# Altium schematic sheet FlyWheel_UI.SchDoc
size A1; SheetNumber: 1; SheetTotal: 1; SPICEModelCacheKDAIGYVS: <root> / <DocumentId>KDAIGYVS</DocumentId> / <CacheFrame Number="0"> / <Model Name="7850_74477530_1m" Kind="CKT"> / <Text>******* / .subckt 7850_74477530_1m 1 2 / Rp 1 2 187304.915771 / Cp 1 2 4.36976277949p / Rs 1 N3 3.3 / L1 N3 2 1000u / .ends 7850_74477530_1m</Text> / </Model> / </CacheFrame> / </root>
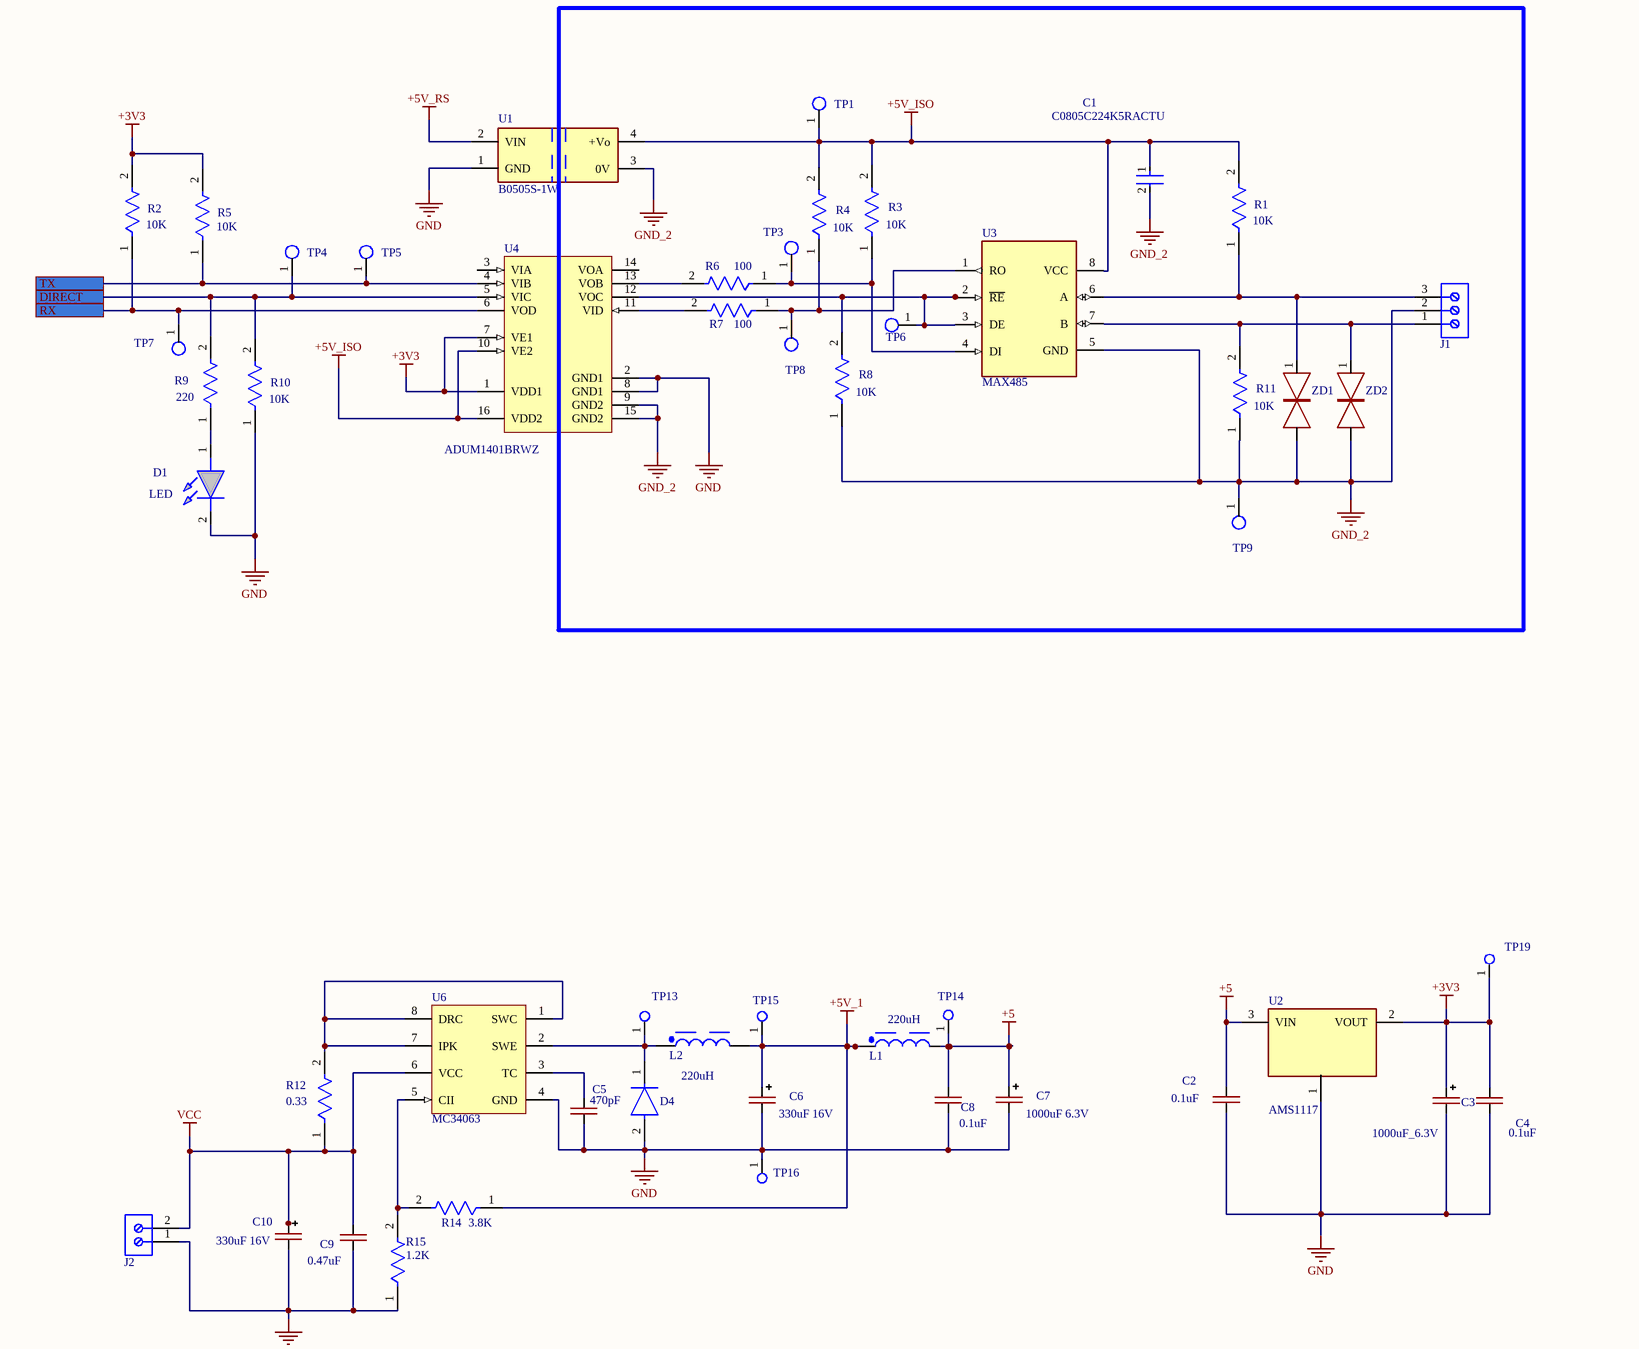
[diagram p0: FlyWheel_UI.SchDoc, top left]
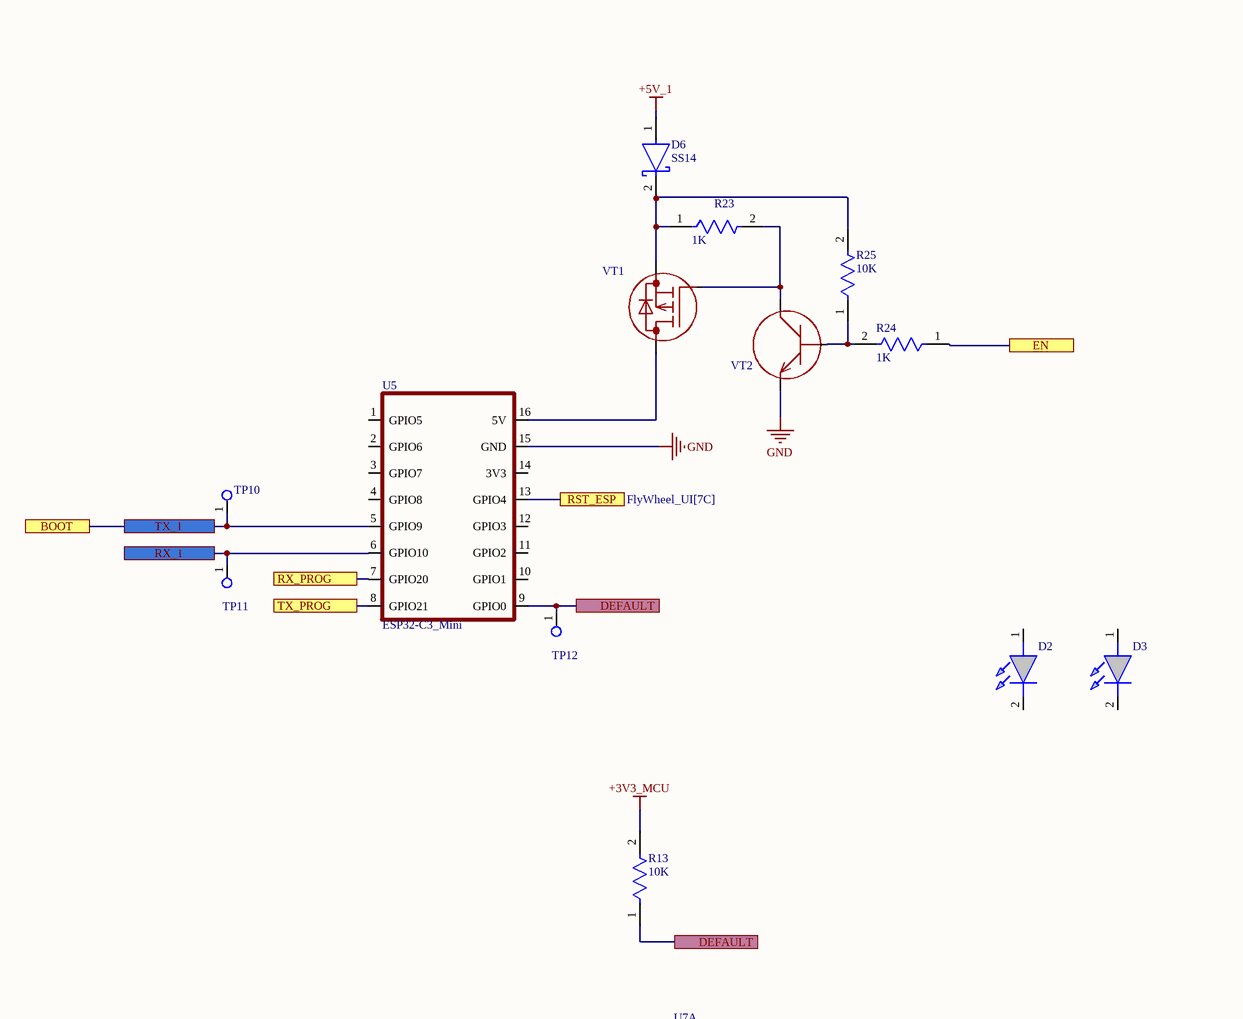
[diagram p1: FlyWheel_UI.SchDoc, top right]
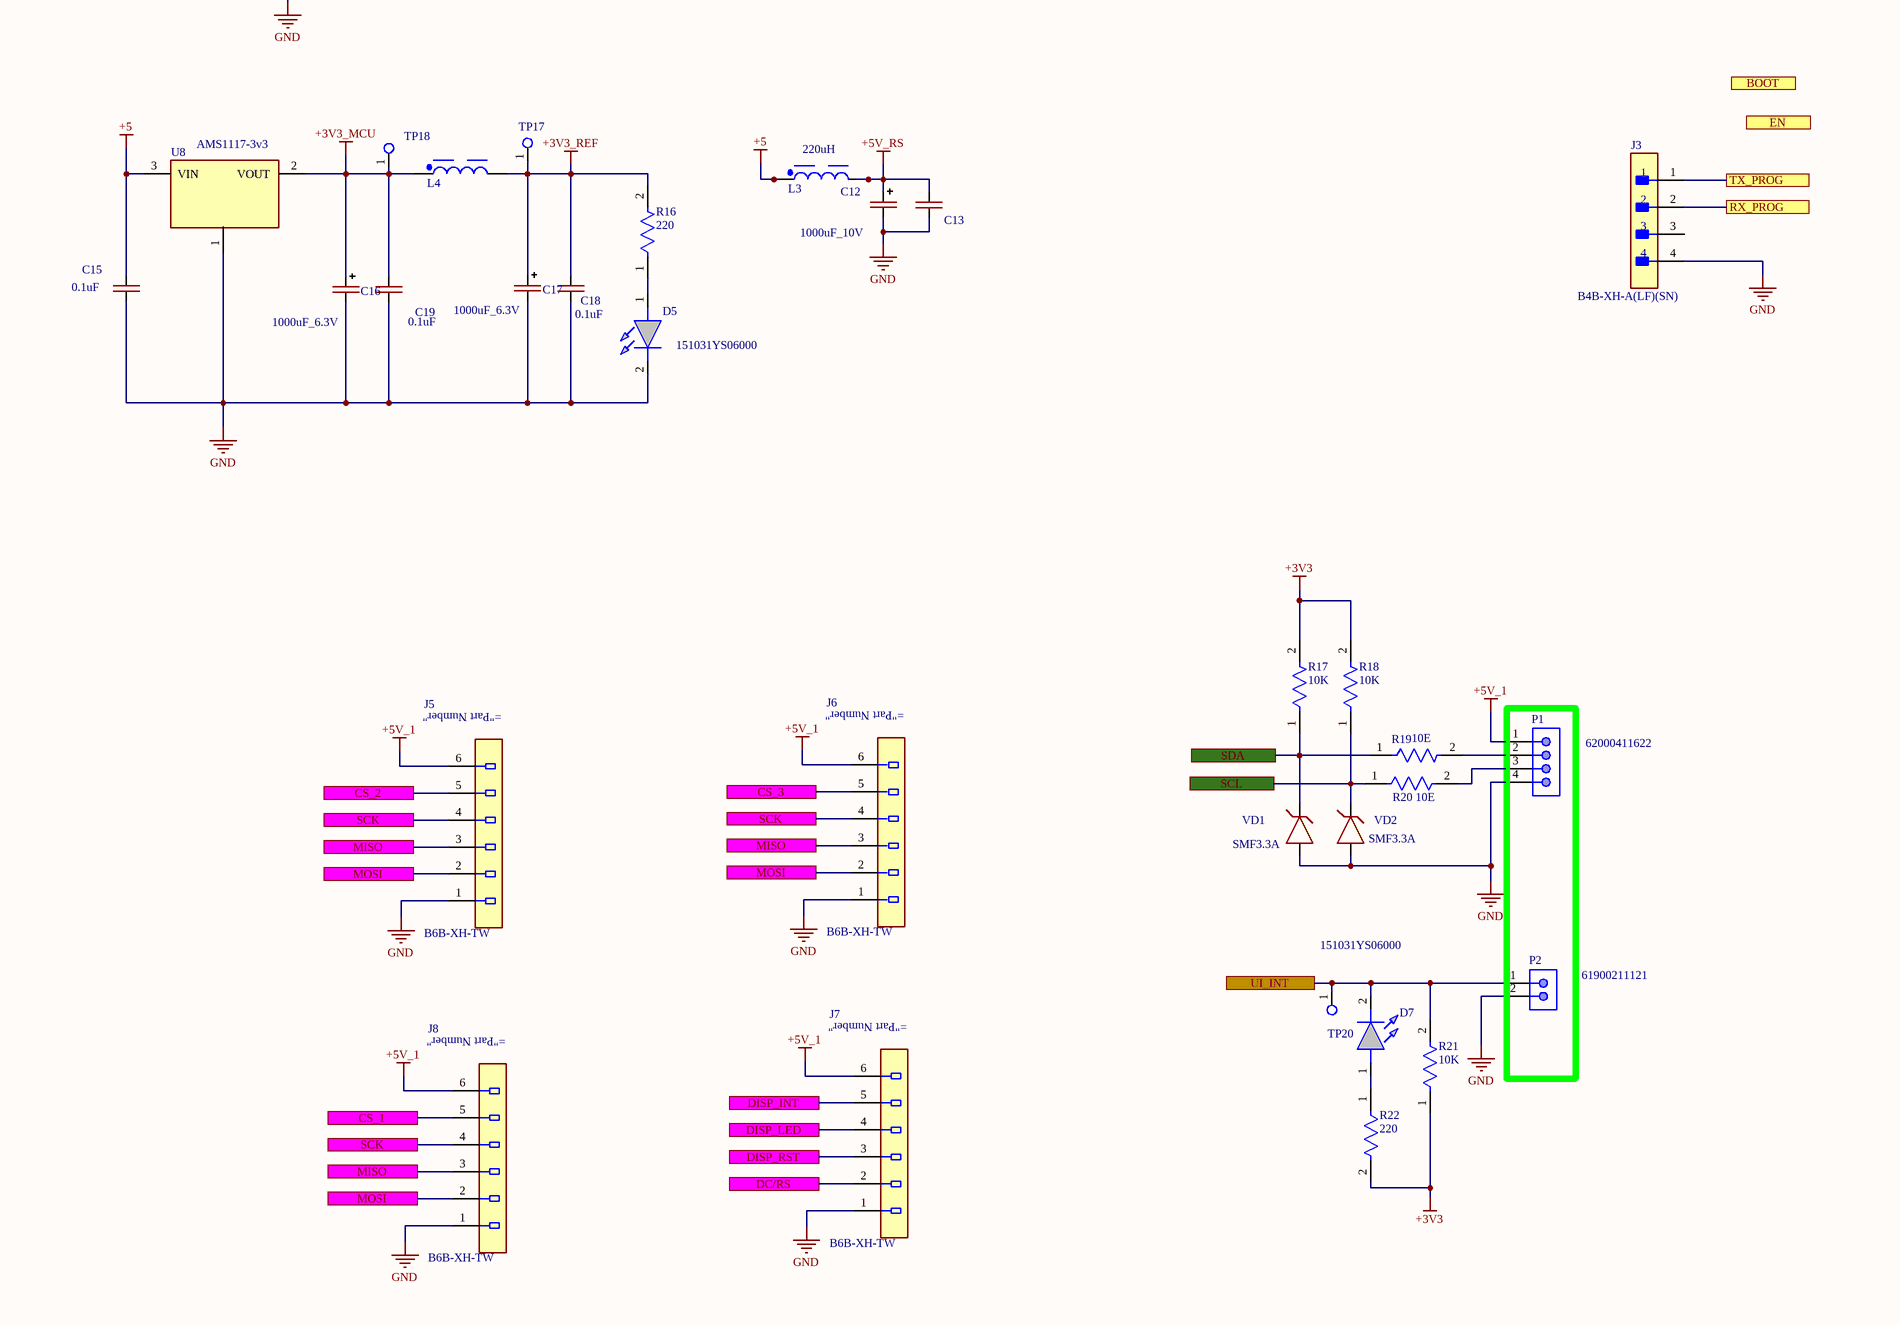
[diagram p2: FlyWheel_UI.SchDoc, bottom left]
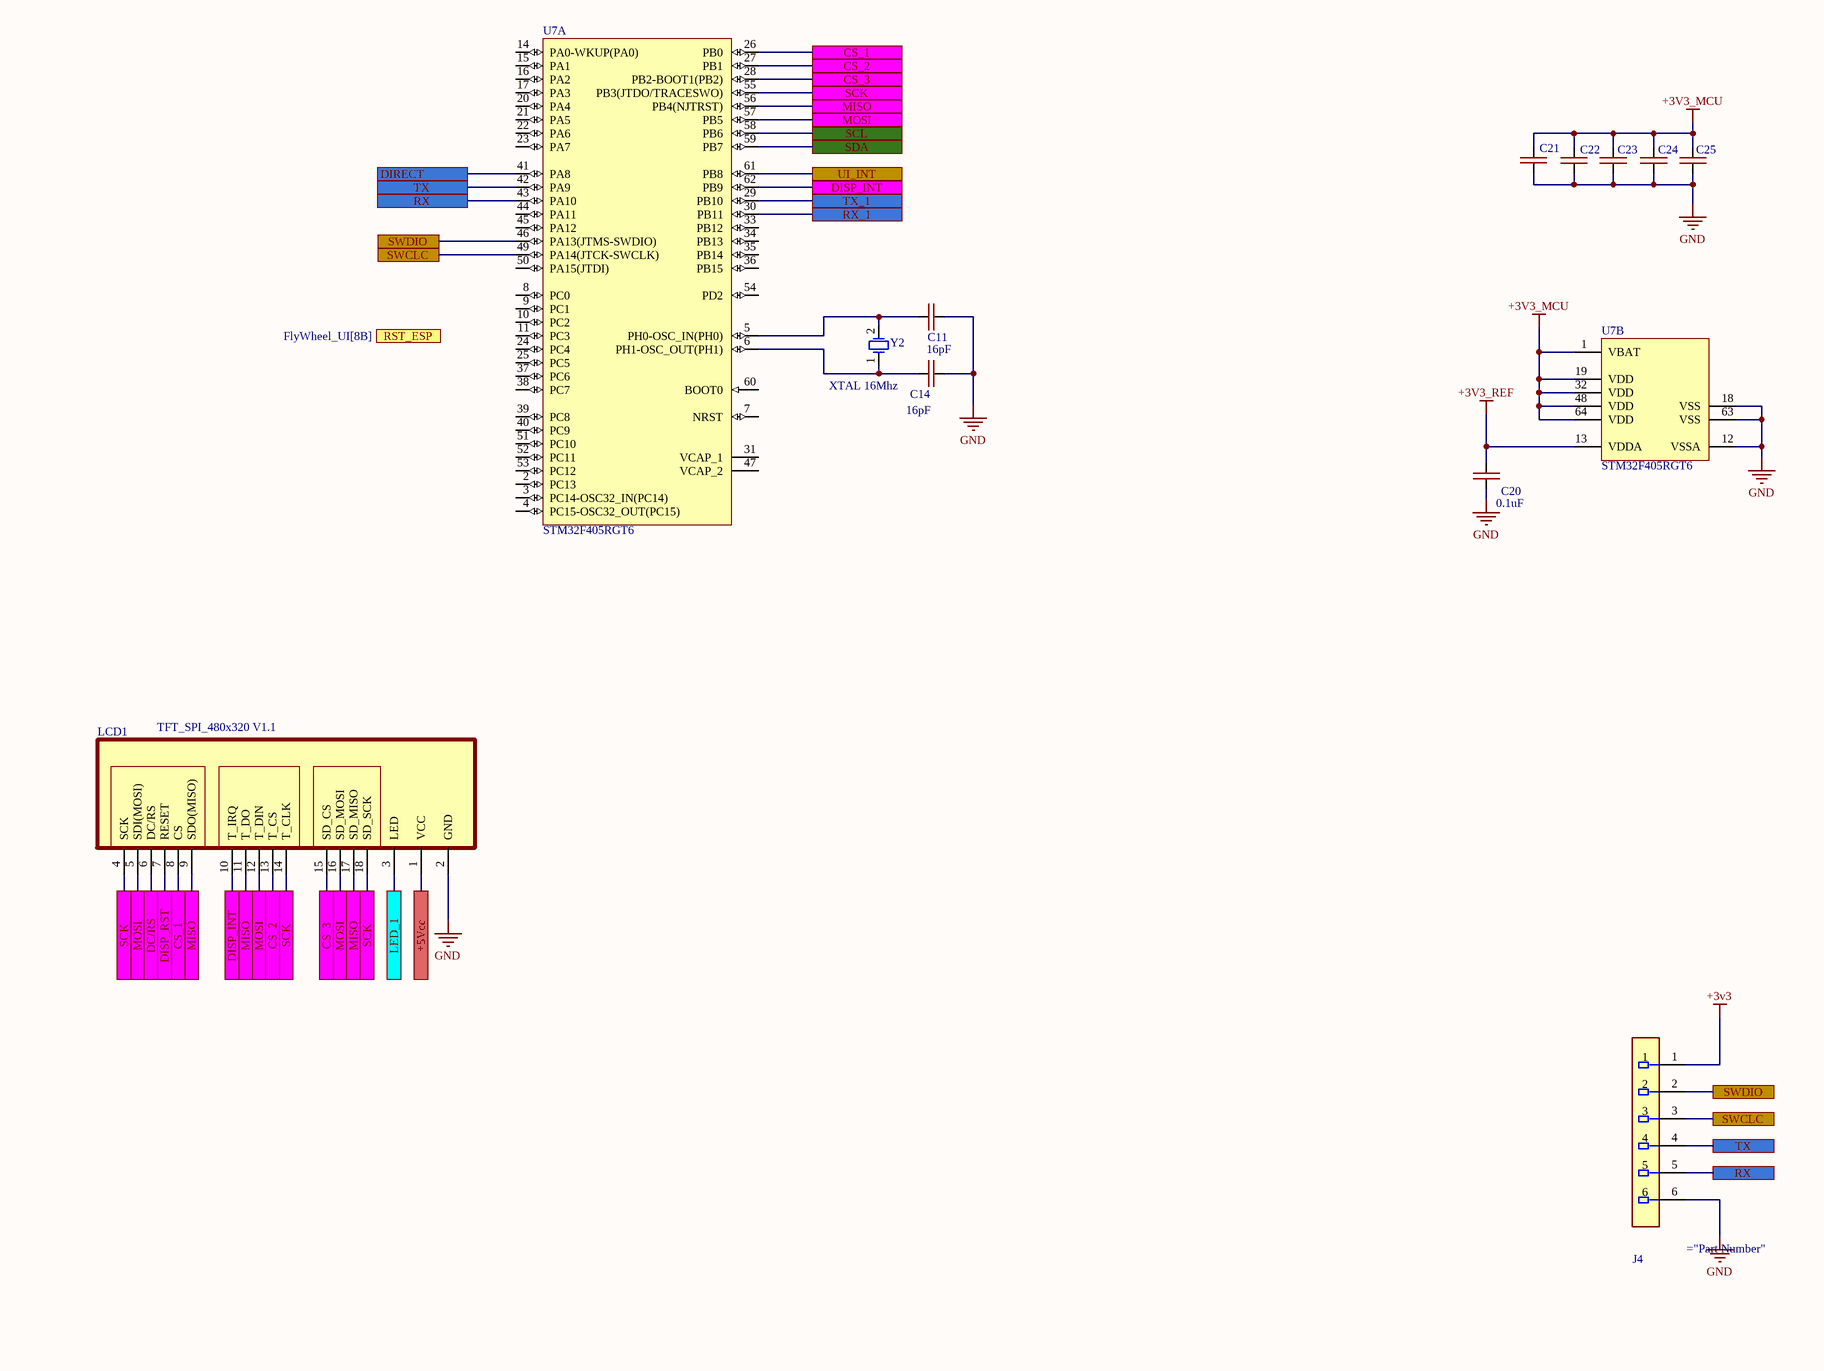
[diagram p3: FlyWheel_UI.SchDoc, bottom right]

## Parts
C1  C0805C224K5RACTU  [FP-C0805C-DN-MFG]
C2  0.1uF  [CAP-0805]
C3  1000uF_6.3V  [CAP_SMD_Size_E]
C4  0.1uF  [CAP-0805]
C5  470pF  [CAP-0805]
C6  330uF 16V  [CAP_SMD_Size_E]
C7  1000uF 6.3V  [CAP_SMD_Size_E]
C8  0.1uF  [CAP-0805]
C9  0.47uF  [CAP-0805]
C10  330uF 16V  [CAP_SMD_Size_E]
C11  16pF  [CAP-0805]
C12  1000uF_10V  [CAP_SMD_Size_G]
C13  CAP-NON-POLAR  [CAP-0805]  (value not drawn)
C14  16pF  [CAP-0805]
C15  0.1uF  [CAP-0805]
C16  1000uF_6.3V  [CAP_SMD_Size_E]
C17  1000uF_6.3V  [CAP_SMD_Size_E]
C18  0.1uF  [CAP-0805]
C19  0.1uF  [CAP-0805]
C20  0.1uF  [CAP-0805]
C21  CAP-NON-POLAR  [CAP-0805]  (value not drawn)
C22  CAP-NON-POLAR  [CAP-0805]  (value not drawn)
C23  CAP-NON-POLAR  [CAP-0805]  (value not drawn)
C24  CAP-NON-POLAR  [CAP-0805]  (value not drawn)
C25  CAP-NON-POLAR  [CAP-0805]  (value not drawn)
D1  LED  [LED_BLUE]
D2  151031YS06000  [LED_BLUE]  (value not drawn)
D3  151031YS06000  [LED_RED]  (value not drawn)
D4  US1G  [US1G_SMA]  (value not drawn)
D5  151031YS06000  [LED_GREEN]
D6  SS14  [DO-214-AC]
D7  151031YS06000  [LED_RED]
J1  (no value)  [691101710003]
J2  691101710002  [691101710002]  (value not drawn)
J3  B4B-XH-A(LF)(SN)  [B4B-XH-A]
J4  SWR25X-NRTC-S06-ST-BA  [Sullins_SWR25X-NRTC-S06-ST-BA_MFG]  (value not drawn)
J5  B6B-XH-TW  [B6B-XH-TW]
J6  B6B-XH-TW  [B6B-XH-TW]
J7  B6B-XH-TW  [B6B-XH-TW]
J8  B6B-XH-TW  [B6B-XH-TW]
L1  220uH  [WE-PD2_7850]
L2  220uH  [WE-PD2_7850]
L3  220uH  [WE-PD2_7850]
L4  1000µH, 0.3A  [WE-PD2_7850]  (value not drawn)
LCD1  TFT_SPI_480x320 V1.1  [LCD_TFT_4.0"]
P1  62000411622  [62000411622]
P2  61900211121  [61900211121]
R1  10K  [RES-0805]
R2  10K  [RES-0805]
R3  10K  [RES-0805]
R4  10K  [RES-0805]
R5  10K  [RES-0805]
R6  100  [RES-0805]
R7  100  [RES-0805]
R8  10K  [RES-0805]
R9  220  [RES-0805]
R10  10K  [RES-0805]
R11  10K  [RES-0805]
R12  0.33  [RES-2512]
R13  10K  [RES-0805]
R14  3.8K  [RES-0805]
R15  1.2K  [RES-0805]
R16  220  [RES-0805]
R17  10K  [RES-0805]
R18  10K  [RES-0805]
R19  10E  [RES-0805]
R20  10E  [RES-0805]
R21  10K  [RES-0805]
R22  220  [RES-0805]
R23  1K  [RES-0805]
R24  1K  [RES-0805]
R25  10K  [RES-0805]
TP1  Test_Point_PCB  [Test_Point]  (value not drawn)
TP3  Test_Point_PCB  [Test_Point]  (value not drawn)
TP4  Test_Point_PCB  [Test_Point]  (value not drawn)
TP5  Test_Point_PCB  [Test_Point]  (value not drawn)
TP6  Test_Point_PCB  [Test_Point]  (value not drawn)
TP7  Test_Point_PCB  [Test_Point]  (value not drawn)
TP8  (no value)  [Test_Point]
TP9  Test_Point_PCB  [Test_Point]  (value not drawn)
TP10  Test_Point_PCB  [Test_Point]  (value not drawn)
TP11  Test_Point_PCB  [Test_Point]  (value not drawn)
TP12  Test_Point_PCB  [Test_Point]  (value not drawn)
TP13  Test_Point_PCB  [Test_Point]  (value not drawn)
TP14  Test_Point_PCB  [Test_Point]  (value not drawn)
TP15  Test_Point_PCB  [Test_Point]  (value not drawn)
TP16  Test_Point_PCB  [Pin_Test_Point(Orange)]  (value not drawn)
TP17  Test_Point_PCB  [Test_Point]  (value not drawn)
TP18  Test_Point_PCB  [Test_Point]  (value not drawn)
TP19  Test_Point_PCB  [Test_Point]  (value not drawn)
TP20  Test_Point_PCB  [Test_Point]  (value not drawn)
U1  B0505S-1W  [B0505S-1W]
U2  AMS1117  [SOT-89]
U3  MAX485  [SOIC-8-MFG]
U4  ADUM1401BRWZ  [ADI-RW-16_M]
U5  ESP32-C3_Mini  [ESP32-C3_PLS]
U6  MC34063  [SOIC-8_M]
U7  STM32F405RGT6  [LQFP64_L]  (parts A,B of 2)
U8  AMS1117-3v3  [SOT-223-3]
VD1  SMF3.3A  [SMF3.3A]
VD2  SMF3.3A  [SMF3.3A]
VT1  MOSFET-P-CH  [SOT23-3]  (value not drawn)
VT2  BC847-BEC  [SOT23-3]  (value not drawn)
Y2  XTAL 16Mhz  [HC-49_THD]
ZD1  P6SMB16CA  [DO-214AA]  (value not drawn)
ZD2  P6SMB16CA  [DO-214AA]  (value not drawn)

## Ports
+5Vcc, BOOT (see FlyWheel_UI[6B]), CS_1 (see FlyWheel_UI[2D], FlyWheel_UI[7C]), CS_1 (see FlyWheel_UI[2D], FlyWheel_UI[9B]), CS_1 (see FlyWheel_UI[7C], FlyWheel_UI[9B]), CS_2 (see FlyWheel_UI[2C], FlyWheel_UI[7C]), CS_2 (see FlyWheel_UI[2C], FlyWheel_UI[9B]), CS_2 (see FlyWheel_UI[7C], FlyWheel_UI[9B]), CS_3 (see FlyWheel_UI[3C], FlyWheel_UI[7C]), CS_3 (see FlyWheel_UI[3C], FlyWheel_UI[9B]), CS_3 (see FlyWheel_UI[7C], FlyWheel_UI[9B]), DC/RS (see FlyWheel_UI[3D]), DC/RS (see FlyWheel_UI[7C]), DEFAULT (see FlyWheel_UI[8B]), DIRECT (see FlyWheel_UI[1A]), DIRECT (see FlyWheel_UI[7B]), DISP_INT (see FlyWheel_UI[3D], FlyWheel_UI[7C]), DISP_INT (see FlyWheel_UI[3D], FlyWheel_UI[9B]), DISP_INT (see FlyWheel_UI[7C], FlyWheel_UI[9B]), DISP_LED, DISP_RST (see FlyWheel_UI[3D]), DISP_RST (see FlyWheel_UI[7C]), EN (see FlyWheel_UI[6C]), EN (see FlyWheel_UI[9A]), LED_1, MISO (see FlyWheel_UI[2D], FlyWheel_UI[3D], FlyWheel_UI[7C]), MISO (see FlyWheel_UI[2D], FlyWheel_UI[3D], FlyWheel_UI[7C], FlyWheel_UI[9B]), MISO (see FlyWheel_UI[2D], FlyWheel_UI[7C], FlyWheel_UI[9B]), MOSI (see FlyWheel_UI[2D], FlyWheel_UI[3D], FlyWheel_UI[7C]), MOSI (see FlyWheel_UI[2D], FlyWheel_UI[3D], FlyWheel_UI[7C], FlyWheel_UI[9B]), MOSI (see FlyWheel_UI[2D], FlyWheel_UI[7C], FlyWheel_UI[9B]), RST_ESP (see FlyWheel_UI[7C]), RST_ESP (see FlyWheel_UI[8B]), RX (see FlyWheel_UI[1A], FlyWheel_UI[7B]), RX (see FlyWheel_UI[1A], FlyWheel_UI[11D]), RX (see FlyWheel_UI[7B], FlyWheel_UI[11D]), RX_1 (see FlyWheel_UI[6B]), RX_1 (see FlyWheel_UI[9B]), RX_PROG (see FlyWheel_UI[6C]), RX_PROG (see FlyWheel_UI[7B]), SCK (see FlyWheel_UI[2C], FlyWheel_UI[2D], FlyWheel_UI[3C], FlyWheel_UI[7C]), SCK (see FlyWheel_UI[2C], FlyWheel_UI[2D], FlyWheel_UI[3C], FlyWheel_UI[7C], FlyWheel_UI[9B]), SCK (see FlyWheel_UI[2C], FlyWheel_UI[2D], FlyWheel_UI[7C], FlyWheel_UI[9B]), SCK (see FlyWheel_UI[2C], FlyWheel_UI[3C], FlyWheel_UI[7C], FlyWheel_UI[9B]), SCK (see FlyWheel_UI[2D], FlyWheel_UI[3C], FlyWheel_UI[7C], FlyWheel_UI[9B]), SCL (see FlyWheel_UI[4C]), SCL (see FlyWheel_UI[9B]), SDA (see FlyWheel_UI[4C]), SDA (see FlyWheel_UI[9B]), SWCLC (see FlyWheel_UI[7B]), SWCLC (see FlyWheel_UI[11D]), SWDIO (see FlyWheel_UI[7B]), SWDIO (see FlyWheel_UI[11D]), TX (see FlyWheel_UI[1A], FlyWheel_UI[7B]), TX (see FlyWheel_UI[1A], FlyWheel_UI[11D]), TX (see FlyWheel_UI[7B], FlyWheel_UI[11D]), TX_1 (see FlyWheel_UI[6B]), TX_1 (see FlyWheel_UI[9B]), TX_PROG (see FlyWheel_UI[6C]), TX_PROG (see FlyWheel_UI[7B]), UI_INT (see FlyWheel_UI[4D]), UI_INT (see FlyWheel_UI[9B])

## Nets
+3V3: C3.1(+) C4.2 J4.1 R2.2 R5.2 R17.2 R18.2 R21.1 R22.2 TP19.1(G9) U2.2(VOUT) U4.1(VDD1) U4.7(VE1)
+3V3_MCU: C16.1(+) C19.2 C21.1 C22.1 C23.1 C24.1 C25.1 L4.1 R13.2 TP18.1(G9) U7.1(VBAT) U7.19(VDD) U7.32(VDD) U7.48(VDD) U7.64(VDD) U8.2(VOUT)
+3V3_REF: C17.1(+) C18.2 C20.2 L4.2 R16.2 TP17.1(G9) U7.13(VDDA)
+5: C2.2 C7.1(+) C8.2 C15.2 L1.2 L3.1 TP14.1(G9) U2.3(VIN) U8.3(VIN)
+5V_1: C6.1(+) D6.1(A) J5.6 J6.6 J7.6 J8.6 L1.1 L2.2 P1.1 R14.1 TP15.1(G9)
+5V_ISO: C1.1 R1.2 R3.2 R4.2 TP1.1(G9) U1.4(+Vo) U3.8(VCC) U4.10(VE2) U4.16(VDD2)
+5V_RS: C12.1(+) C13.2 L3.2 U1.2(VIN)
GND: C2.1 C3.2(-) C4.1 C5.2 C6.2(-) C7.2(-) C8.1 C9.2 C10.2(-) C11.2 C12.2(-) C13.1 C14.2 C15.1 C16.2(-) C17.2(-) C18.1 C19.1 C20.1 C21.2 C22.2 C23.2 C24.2 C25.2 D1.2(K) D4.2(A) D5.2(K) J2.1 J3.4 J4.6 J5.1 J6.1 J7.1 J8.1 LCD1.2(GND) P1.4 P2.2 R10.1 R15.1 TP16.1(G9) U1.1(GND) U2.1(Ground) U4.2(GND1) U4.8(GND1) U5.15(GND) U6.4(GND) U7.12(VSSA) U7.18(VSS) U7.63(VSS) U8.1(Ground) VD1.2(A) VD2.2(A) VT2.2(E)
GND_2: C1.2 J1.2 R8.1 R11.1 TP9.1(G9) U1.3(0V) U3.5(GND) U4.9(GND2) U4.15(GND2) ZD1.2(A) ZD2.2(A)
VCC: C9.1 C10.1(+) J2.2 R12.1 U6.6(VCC)
+5Vcc: LCD1.1(VCC) ; port +5Vcc
BOOT: TP10.1(G9) U5.5(GPIO9) U7.29(PB10) ; port TX_1, port BOOT
CS_1: J8.5 LCD1.8(CS) U7.26(PB0) ; port CS_1
CS_2: J5.5 LCD1.13(T_CS) U7.27(PB1) ; port CS_2
CS_3: J6.5 LCD1.15(SD_CS) U7.28(PB2-BOOT1(PB2)) ; port CS_3
DC/RS: J7.2 LCD1.6(DC/RS) ; port DC/RS
DEFAULT: R13.1 TP12.1(G9) U5.9(GPIO0) ; port DEFAULT
DIRECT: R9.2 R10.2 TP4.1(G9) U4.5(VIC) U7.41(PA8) ; port DIRECT
DISP_INT: J7.5 LCD1.10(T_IRQ) U7.62(PB9) ; port DISP_INT
DISP_LED: J7.4 ; port DISP_LED
DISP_RST: J7.3 LCD1.7(RESET) ; port DISP_RST
EN: R24.1 ; port EN
LED_1: LCD1.3(LED) ; port LED_1
MISO: J5.3 J6.3 J8.3 LCD1.9(SDO(MISO)) LCD1.11(T_DO) LCD1.17(SD_MISO) U7.56(PB4(NJTRST)) ; port MISO
MOSI: J5.2 J6.2 J8.2 LCD1.5(SDI(MOSI)) LCD1.12(T_DIN) LCD1.16(SD_MOSI) U7.57(PB5) ; port MOSI
RST_ESP: U5.13(GPIO4) ; port RST_ESP
RX: J4.5 R2.1 TP7.1(G9) U4.6(VOD) U7.43(PA10) ; port RX
RX_1: TP11.1(G9) U5.6(GPIO10) U7.30(PB11) ; port RX_1
RX_PROG: J3.2 U5.7(GPIO20) ; port RX_PROG
SCK: J5.4 J6.4 J8.4 LCD1.4(SCK) LCD1.14(T_CLK) LCD1.18(SD_SCK) U7.55(PB3(JTDO/TRACESWO)) ; port SCK
SCL: R18.1 R20.1 U7.58(PB6) VD2.1(C) ; port SCL
SDA: R17.1 R19.1 U7.59(PB7) VD1.1(C) ; port SDA
SWCLC: J4.3 U7.49(PA14(JTCK-SWCLK)) ; port SWCLC
SWDIO: J4.2 U7.46(PA13(JTMS-SWDIO)) ; port SWDIO
TX: J4.4 R5.1 TP5.1(G9) U4.4(VIB) U7.42(PA9) ; port TX
TX_PROG: J3.1 U5.8(GPIO21) ; port TX_PROG
UI_INT: D7.2(K) P2.1 R21.2 TP20.1(G9) U7.61(PB8) ; port UI_INT
NetC5_1: C5.1 U6.3(TC)
NetC11_1: C11.1 U7.5(PH0-OSC_IN(PH0)) Y2.2
NetC14_1: C14.1 U7.6(PH1-OSC_OUT(PH1)) Y2.1
NetD1_1: D1.1(A) R9.1
NetD4_1: D4.1(C) L2.1 TP13.1(G9) U6.2(SWE)
NetD5_1: D5.1(A) R16.1
NetD6_2: D6.2(C) R23.1 R25.2 VT1.2(S)
NetD7_1: D7.1(A) R22.1
NetJ1_1: J1.1 R11.2 U3.7(B) ZD2.1(A)
NetJ1_3: J1.3 R1.1 U3.6(A) ZD1.1(A)
NetP1_2: P1.2 R19.2
NetP1_3: P1.3 R20.2
NetR3_1: R3.1 R6.1 TP3.1(G9) U3.4(DI)
NetR4_1: R4.1 R7.1 TP8.1(G9) U3.1(RO)
NetR6_2: R6.2 U4.13(VOB)
NetR7_2: R7.2 U4.11(VID)
NetR8_2: R8.2 TP6.1(G9) U3.2(~{RE}) U3.3(DE) U4.12(VOC)
NetR12_2: R12.2 U6.1(SWC) U6.7(IPK) U6.8(DRC)
NetR14_2: R14.2 R15.2 U6.5(CII)
NetR23_2: R23.2 VT1.1(G) VT2.3(C)
NetR24_2: R24.2 R25.1 VT2.1(B)
NetU5_16: U5.16(5V) VT1.3(D)

Not connected (* = marked no-connect by the designer): D2 1(A) 2(K); D3 1(A) 2(K); J3 3; U4 3(VIA) 14(VOA); U5 1(GPIO5) 2(GPIO6) 3(GPIO7) 4(GPIO8) 10(GPIO1) 11(GPIO2) 12(GPIO3) 14(3V3); U7 2(PC13) 3(PC14-OSC32_IN(PC14)) 4(PC15-OSC32_OUT(PC15)) 7(NRST) 8(PC0) 9(PC1) 10(PC2) 11(PC3) 14(PA0-WKUP(PA0)) 15(PA1) 16(PA2) 17(PA3) 20(PA4) 21(PA5) 22(PA6) 23(PA7) 24(PC4) 25(PC5) 31(VCAP_1) 33(PB12) 34(PB13) 35(PB14) 36(PB15) 37(PC6) 38(PC7) 39(PC8) 40(PC9) 44(PA11) 45(PA12) 47(VCAP_2) 50(PA15(JTDI)) 51(PC10) 52(PC11) 53(PC12) 54(PD2) 60(BOOT0)

## Library data of the parts
C1 = CMP-1036-04552-2: CAP CER 0.22UF 50V X7R 0805; Manufacturer: KEMET; Value: 0.22 μF; Temperature Coefficient: 30ppm/°C; Material: Ceramic; Tolerance: 0.1; ComponentLink2URL: https://content.kemet.com/datasheets/KEM_C1003_C0G_SMD.pdf; Temperature Characteristic: X7R; Device Class L3: Ceramic Capacitors; Lead Free: Yes; Temperature: -55°C to +125°C; RoHS: TRUE; Capacitance: 0.22 μF; Automotive: No; Octopart: https://octopart.com/c0805c224k5ractu-kemet-144670; Manufacturer Part Number: C0805C224K5RACTU; Temperature Range Low: -55°C; Height: 0.88mm; Device Class L1: Passive Components; Digikey Description: CAP CER 0.22UF 50V X7R 0805; ComponentLink2Description: Datasheet; Mouser Description: CAP CER 0.22UF 50V X7R 0805; Category: Cap; Ipc Land Pattern Name: CAPC200125X78; Temperature Range High: +125°C; Package: C0805C-DN; Device Class L2: Capacitors; Voltage Rating: 50 V
C2 C4 C5 C8 C9 C11 C14 C15 C18-C20 = CAP-NON-POLAR
C3 C12 C16 C17 = CAP-POLAR
C6 C7 C10 = CAP_POL_SMD
D1-D3 D5 D7 = LED: WURTH ELEKTRONIK - 151031YS06000 - LED, Yellow, Through Hole, T-1 (3mm), 30 mA, 2 V, 590 nm; Geometry.Height: 5.5mm; Manufacturer_Name: Wurth Elektronik; Manufacturer_Part_Number: 151031YS06000; Mouser Part Number: 710-151031YS06000; Mouser Price/Stock: https://www.mouser.co.uk/ProductDetail/Wurth-Elektronik/151031YS06000?qs=LlUlMxKIyB3xSYYW%252BcuBiQ%3D%3D; Arrow Part Number: *; Arrow Price/Stock: *; Mouser Testing Part Number: *; Mouser Testing Price/Stock: *; Datasheet Link: https://katalog.we-online.de/led/datasheet/151031YS06000.pdf
J1 = 691101710003: WR-TBL Series 101 Horizontal Entry Modular, Through Hole, pitch 5mm, 3p; Manufacturer: Wurth Elektronik; Pin Number: 3; Rated Current: 16A; Working Voltage: 250V; PCB/Cable/Panel: PCB; Modularity: Yes; ComponentLink1Description: Manufacturer Link; ComponentLink1URL: https://www.we-online.com/redexpert/article/691101710003?ad; ComponentLink2Description: Datasheet; ComponentLink2URL: https://www.we-online.com/redexpert/spec/691101710003?ad; Category: Terminal Blocks; Match Code: WR-TBL; Manufacturer Part Number: 691101710003; Mount: Through Hole; Operating Temperature Max: 105°C; Operating Temperature Min: -40°C; Packaging: Box; Pitch: 5mm; Orientation: Horizontal; Application: Pressure Clamp
J2 = 691101710002: WR-TBL Series 101 Horizontal Entry Modular, THT, pitch 5mm, 2p; Manufacturer: Wurth Elektronik; Modularity: Yes; Rated Current: 16A; Working Voltage: 250V; ComponentLink1Description: Website Link; ComponentLink1URL: https://www.we-online.com/redexpert/article/691101710002?ad; ComponentLink2Description: Datasheet Link; ComponentLink2URL: https://www.we-online.com/redexpert/spec/691101710002?ad; Manufacturer Part Number: 691101710002; Category: Terminal Blocks; Match Code: WR-TBL; Mount: Through Hole; Operating Temperature Max: 105°C; Operating Temperature Min: -40°C; Packaging: Box; Application: Pressure Clamp; Number of Pins: 2; Number of Rows: 1; Orientation: Horizontal; Pitch: 5mm
L1-L4 = 74477530: WE-PD2 SMT Power Inductor, size 7850, 1000µH, 0.3A, 3.3Ω; Manufacturer: Wurth Elektronik; Case/Size Code: 7850; DC Resistance: 2.78Ω; Self Resonant Frequency: 2.4MHz; Manufacturer Part Number: 74477530; Category: Unshielded Power Inductors; Match Code: WE-PD2; ComponentLink1Description: Website Link; ComponentLink1URL: https://www.we-online.com/redexpert/article/74477530?ad; ComponentLink2Description: Datasheet Link; ComponentLink2URL: https://www.we-online.com/redexpert/spec/74477530?ad; Mount: Surface Mount; Operating Temperature Max: 125°C; Operating Temperature Min: -40°C; Packaging: Tape and Reel; Length: 7.8mm; Width: 7mm; Height: 4.95mm; DC Resistance Max: 3.3Ω; Inductance: 1000µH; Rated Current: 0.3A; Saturation Current: 0.3A
P1 = 62000411622: WR-WTB Male Vertical Shrouded Header, pitch 2mm, 4p; Pin Number: 4; Contact Resistance: 20mOhm; Rated Current: 2A; Withstanding Voltage: 800VAC; Working Voltage: 125VAC; ComponentLink1Description: Manufacturer; ComponentLink1URL: http://www.we-online.de; ComponentLink2Description: Datasheet; ComponentLink2URL: https://www.we-online.com/catalog/datasheet/62000411622.pdf; Pitch: 2mm; Published Date: January 2020; Publisher: Wurth Elektronik; Mounting Technology: THT; Packaging: Bag; Operating Temperature: -25 to +85degC; Part Number: 62000411622; Gender: Male; Type: Vertical
P2 = 61900211121: WR-WTB THT Male Vertical Locking Header, pitch 2.54mm, 2p; Pin Number: 2; Contact Resistance: 20mOhm; Rated Current: 3A; Withstanding Voltage: 1000VAC; Working Voltage: 250VAC; ComponentLink1Description: Manufacturer; ComponentLink1URL: http://www.we-online.de; ComponentLink2Description: Datasheet; ComponentLink2URL: https://www.we-online.com/catalog/datasheet/61900211121.pdf; Pitch: 2.54mm; Published Date: January 2020; Publisher: Wurth Elektronik; Mounting Technology: THT; Packaging: Bag; Operating Temperature: -40 to +105degC; Part Number: 61900211121; Gender: Male; Type: Vertical
R1-R13 R15-R25 = RES-CONST
R14 = RES-CONST: 10K
TP1 TP3-TP20 = TP_PCB?: Test_Point
U4 = CMP-0534-00565-1: Quad Channel Digital Isolator, 2.5 KV rms Insulation Rating, 10 Mbps Data Rate, 50 ns Delay, Industrial, 16-pin SOIC (RW-16), Tube; Manufacturer: Analog Devices; Max Data Rate: 10Mbps; ComponentLink2URL: http://www.analog.com/static/imported-files/data_sheets/ADuM1400_1401_1402.pdf; ComponentLink5Description: URL Link2; ComponentLink3URL: http://www.analog.com/static/imported-files/packages/PKG_PDF/SOIC_WIDE%20%28RW%29/RW_16.pdf; DatasheetVersion: Rev. H; ComponentLink2Description: Datasheet; ComponentLink3Description: Package Specification; PartNumber: ADUM1401BRWZ; ComponentLink5URL: Reference Circuit:http://www.analog.com/en/interface-isolation/digital-isolators/adum1401/products/product.html#product-recommendations; Max Operating Temp (degreesC): 125; PackageReference: RW-16; PackageVersion: 032707-B, 03/2007; ComponentLink1Description: Manufacturer URL; Code_JEDEC: MS-013-AA; PackageDescription: 16-Pin Standard Small Outline Package, Body 10.3 x 7.5 mm, Pitch 1.27 mm; Mounting Technology: Surface Mount; ComponentLink1URL: http://www.analog.com/en/index.html; ComponentLink4Description: URL Link1; ComponentLink4URL: Product URL:http://www.analog.com/en/interface-isolation/digital-isolators/adum1401/products/product.html
U8 = AMS1117
VD1 VD2 = ESD_Unidirect